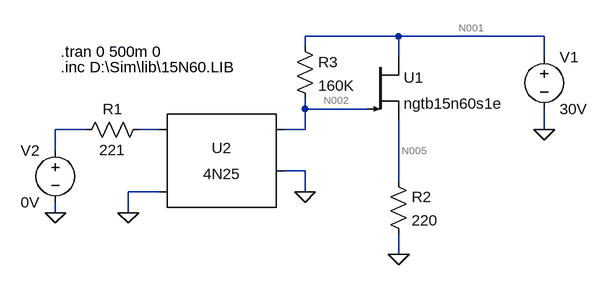
[diagram p0: schematic ponte h alta.asc]
ponte h alta.asc, the LTspice schematic file:
Version 4
SHEET 1 904 724
WIRE 320 0 176 0
WIRE 544 0 320 0
WIRE 176 16 176 0
WIRE 320 32 320 0
WIRE 544 32 544 0
WIRE 176 112 176 96
WIRE 272 112 176 112
WIRE -160 144 -208 144
WIRE -48 144 -80 144
WIRE 176 144 176 112
WIRE 176 144 144 144
WIRE 544 144 544 112
WIRE -208 176 -208 144
WIRE 176 208 144 208
WIRE 320 224 320 128
WIRE -48 240 -96 240
WIRE 176 240 176 208
WIRE -208 272 -208 256
WIRE -96 272 -96 240
WIRE 320 336 320 304
FLAG 544 144 0
FLAG -96 272 0
FLAG -208 272 0
FLAG 320 336 0
FLAG 176 240 0
SYMBOL voltage 544 16 R0
WINDOW 123 0 0 Left 2
WINDOW 39 0 0 Left 2
SYMATTR InstName V1
SYMATTR Value 30V
SYMBOL Optos\\4N25 48 208 R0
SYMATTR InstName U2
SYMBOL voltage -208 160 M0
WINDOW 123 0 0 Left 2
WINDOW 39 0 0 Left 2
SYMATTR InstName V2
SYMATTR Value 0V
SYMBOL res -64 128 R90
WINDOW 0 0 56 VBottom 2
WINDOW 3 32 56 VTop 2
SYMATTR InstName R1
SYMATTR Value 221
SYMATTR SpiceLine tol=1 pwr=0.1
SYMBOL Misc\\nigbt 272 32 R0
SYMATTR InstName U1
SYMATTR Value ngtb15n60s1e
SYMBOL res 304 208 R0
SYMATTR InstName R2
SYMATTR Value 220
SYMATTR SpiceLine tol=5 pwr=1000
SYMBOL res 160 0 R0
SYMATTR InstName R3
SYMATTR Value 160K
SYMATTR SpiceLine tol=1 pwr=0.25
TEXT -200 24 Left 2 !.tran 0 500m 0
TEXT -200 48 Left 2 !.inc D:\\Sim\\lib\\15N60.LIB

The netlist it stands for:
* ponte h alta.asc
V1 N001 0 30V
XU2 N004 0 N002 0 NC_01 4N25
V2 N003 0 0V
R1 N004 N003 221 tol=1 pwr=0.1
Z§U1 N001 N002 N005 ngtb15n60s1e
R2 N005 0 220 tol=5 pwr=1000
R3 N001 N002 160K tol=1 pwr=0.25
.tran 0 500m 0
.inc D:\Sim\lib\15N60.LIB
.lib 4N25.sub
.backanno
.end

* Results of the author's LTspice run, read from the files saved beside the schematic
* Operating Point, zero values left out:
*   V(n001) = 30 V
*   V(n002) = 30 V
*   V(n005) = 22.54 V
*   I(R3) = 640.3 pA
*   I(R2) = 102.5 mA
*   I(V1) = -102.5 mA
*   Ix(u2:3) = 640 pA
*   Ix(u2:4) = -640 pA
*   Ix(u1:1) = 102.5 mA
*   Ix(u1:3) = -102.5 mA